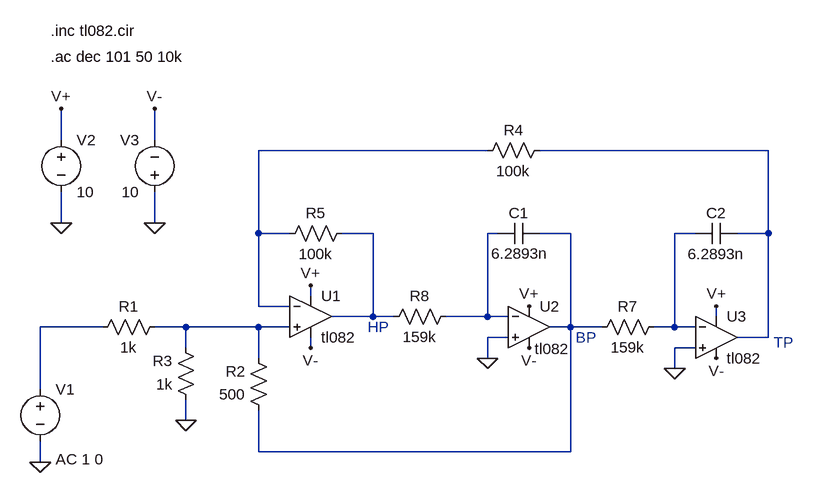
[diagram p0: schematic KHN.asc]
KHN.asc, the LTspice schematic file:
Version 4
SHEET 1 880 680
WIRE -288 -192 -288 -240
WIRE -144 -192 -144 -240
WIRE 368 -176 16 -176
WIRE 800 -176 448 -176
WIRE -288 -64 -288 -112
WIRE -144 -64 -144 -112
WIRE 16 -48 16 -176
WIRE 64 -48 16 -48
WIRE 192 -48 144 -48
WIRE 384 -48 368 -48
WIRE 496 -48 448 -48
WIRE 688 -48 656 -48
WIRE 800 -48 800 -176
WIRE 800 -48 752 -48
WIRE 96 48 96 32
WIRE 16 64 16 -48
WIRE 64 64 16 64
WIRE 192 80 192 -48
WIRE 192 80 128 80
WIRE 224 80 192 80
WIRE 368 80 368 -48
WIRE 368 80 304 80
WIRE 400 80 368 80
WIRE 720 80 720 64
WIRE -224 96 -320 96
WIRE -96 96 -144 96
WIRE 16 96 -96 96
WIRE 64 96 16 96
WIRE 496 96 496 -48
WIRE 496 96 464 96
WIRE 544 96 496 96
WIRE 656 96 656 -48
WIRE 656 96 624 96
WIRE 688 96 656 96
WIRE 400 112 368 112
WIRE 800 112 800 -48
WIRE 800 112 752 112
WIRE -96 128 -96 96
WIRE 96 128 96 112
WIRE 688 128 656 128
WIRE 16 144 16 96
WIRE 368 144 368 112
WIRE 656 160 656 128
WIRE -320 192 -320 96
WIRE -96 240 -96 208
WIRE 16 288 16 224
WIRE 496 288 496 96
WIRE 496 288 16 288
WIRE -320 304 -320 272
FLAG 656 160 0
FLAG 368 144 0
FLAG -96 240 0
FLAG -320 304 0
FLAG -144 -64 0
FLAG -288 -64 0
FLAG -288 -240 V+
FLAG -144 -240 V-
FLAG 96 128 V-
FLAG 432 128 V-
FLAG 720 144 V-
FLAG 96 32 V+
FLAG 432 64 V+
FLAG 720 64 V+
SYMBOL res -128 80 R90
WINDOW 0 0 56 VBottom 2
WINDOW 3 32 56 VTop 2
SYMATTR InstName R1
SYMATTR Value 1k
SYMBOL res 32 240 R180
WINDOW 0 36 76 Left 2
WINDOW 3 36 40 Left 2
SYMATTR InstName R2
SYMATTR Value 500
SYMBOL res -80 224 R180
WINDOW 0 36 76 Left 2
WINDOW 3 36 40 Left 2
SYMATTR InstName R3
SYMATTR Value 1k
SYMBOL res 464 -192 R90
WINDOW 0 0 56 VBottom 2
WINDOW 3 32 56 VTop 2
SYMATTR InstName R4
SYMATTR Value 100k
SYMBOL res 160 -64 R90
WINDOW 0 0 56 VBottom 2
WINDOW 3 32 56 VTop 2
SYMATTR InstName R5
SYMATTR Value 100k
SYMBOL res 640 80 R90
WINDOW 0 0 56 VBottom 2
WINDOW 3 32 56 VTop 2
SYMATTR InstName R7
SYMATTR Value 159k
SYMBOL res 320 64 R90
WINDOW 0 0 56 VBottom 2
WINDOW 3 32 56 VTop 2
SYMATTR InstName R8
SYMATTR Value 159k
SYMBOL cap 448 -64 R90
WINDOW 0 0 32 VBottom 2
WINDOW 3 31 30 VTop 2
SYMATTR InstName C1
SYMATTR Value 6.2893n
SYMBOL cap 752 -64 R90
WINDOW 0 0 32 VBottom 2
WINDOW 3 32 32 VTop 2
SYMATTR InstName C2
SYMATTR Value 6.2893n
SYMBOL voltage -320 176 R0
WINDOW 3 24 96 Invisible 2
WINDOW 123 24 124 Left 2
WINDOW 39 0 0 Left 0
SYMATTR Value SINE(0 1)
SYMATTR Value2 AC 1 0
SYMATTR InstName V1
SYMBOL voltage -288 -208 R0
WINDOW 123 0 0 Left 0
WINDOW 39 0 0 Left 0
SYMATTR InstName V2
SYMATTR Value 10
SYMBOL voltage -144 -96 R180
WINDOW 0 24 96 Left 2
WINDOW 3 24 16 Left 2
WINDOW 123 0 0 Left 0
WINDOW 39 0 0 Left 0
SYMATTR InstName V3
SYMATTR Value 10
SYMBOL Opamps\\opamp2 96 16 R0
SYMATTR InstName U1
SYMATTR Value tl082
SYMBOL Opamps\\opamp2 432 32 R0
WINDOW 3 9 98 Left 2
SYMATTR Value tl082
SYMATTR InstName U2
SYMBOL Opamps\\opamp2 720 48 R0
SYMATTR InstName U3
SYMATTR Value tl082
TEXT -304 -320 Left 2 !.ac dec 101 50 10k
TEXT -304 -360 Left 2 !.inc tl082.cir
TEXT 184 96 Left 2 ;HP
TEXT 504 112 Left 2 ;BP
TEXT 808 120 Left 2 ;TP

The netlist it stands for:
* KHN.asc
R1 N008 N007 1k
R2 N005 N008 500
R3 0 N008 1k
R4 N002 N001 100k
R5 N003 N001 100k
R7 N006 N005 159k
R8 N004 N003 159k
C1 N005 N004 6.2893n
C2 N002 N006 6.2893n
V1 N007 0 SINE(0 1) AC 1 0
V2 V+ 0 10
V3 0 V- 10
XU1 N008 N001 V+ V- N003 tl082  ; pins In+ In- V+ V- OUT
XU2 0 N004 V+ V- N005 tl082  ; pins In+ In- V+ V- OUT
XU3 0 N006 V+ V- N002 tl082  ; pins In+ In- V+ V- OUT
.ac dec 101 50 10k
.inc tl082.cir
* HP
* BP
* TP
.backanno
.end